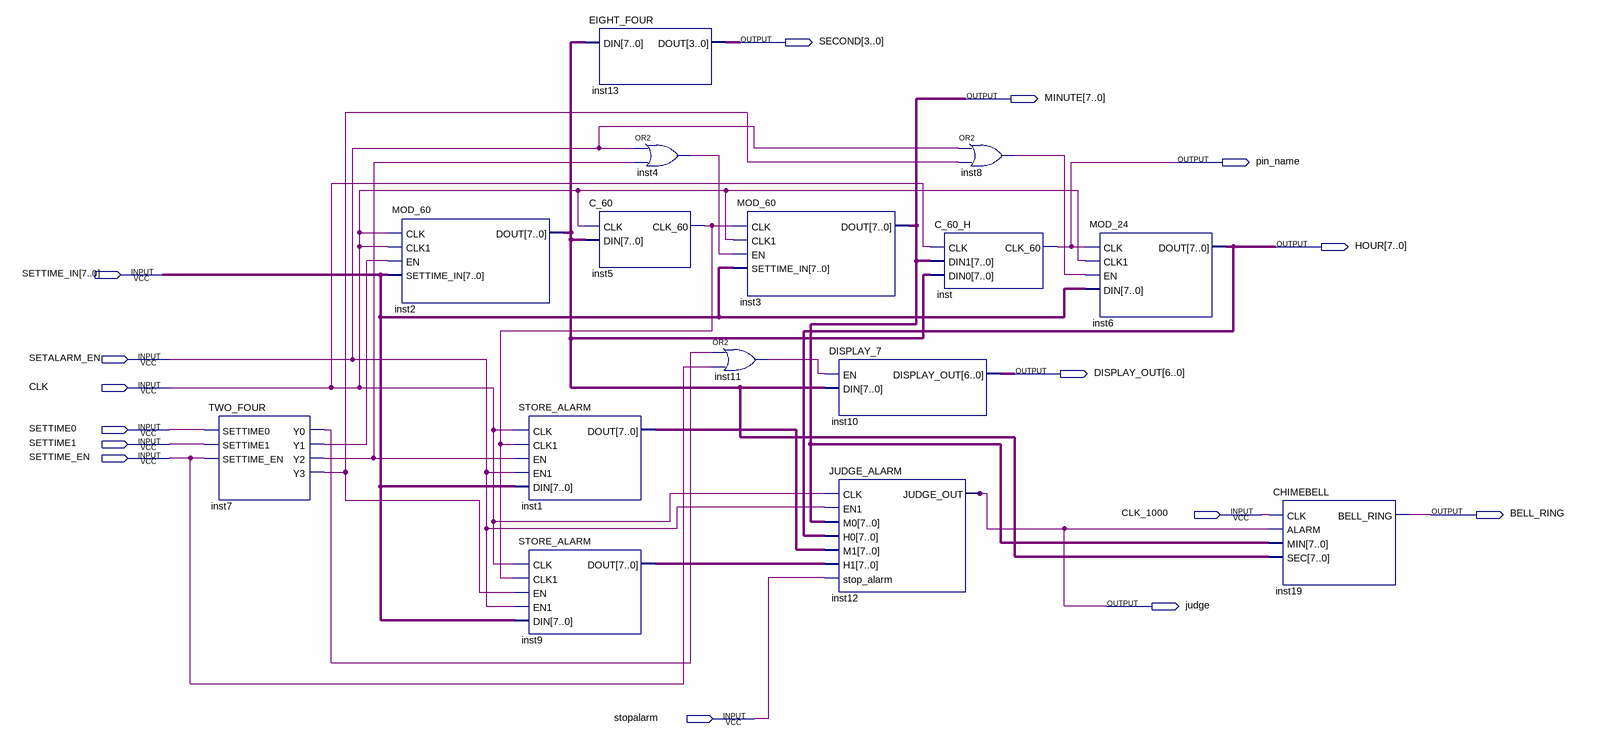
[diagram p0: schematic sheet]
// Quartus schematic DigitalLogic.bdf as structural Verilog: 15 symbols, 15 pins
module DigitalLogic (
  input  [7:0] SETTIME_IN,
  input  SETALARM_EN,
  input  CLK,
  input  SETTIME0,
  input  SETTIME1,
  input  SETTIME_EN,
  input  CLK_1000,
  input  stopalarm,
  output [3:0] SECOND,
  output [7:0] MINUTE,
  output pin_name,
  output [7:0] HOUR,
  output [6:0] DISPLAY_OUT,
  output BELL_RING,
  output judge
);

  wire inst4_out, inst5_clk_60, inst7_y0, inst7_y1, inst7_y2, inst7_y3, inst8_out, inst11_out;
  wire [7:0] inst1_dout, inst2_dout, inst9_dout;

  TWO_FOUR inst7 (
    .SETTIME0(SETTIME0), .SETTIME1(SETTIME1), .SETTIME_EN(SETTIME_EN), .Y0(inst7_y0), .Y1(inst7_y1),
    .Y2(inst7_y2), .Y3(inst7_y3));
  MOD_60 inst2 (.CLK(CLK), .CLK1(CLK), .EN(inst7_y1), .SETTIME_IN(SETTIME_IN), .DOUT(inst2_dout));
  STORE_ALARM inst1 (
    .CLK(CLK), .CLK1(inst5_clk_60), .EN(inst7_y2), .EN1(SETALARM_EN), .DIN(SETTIME_IN), .DOUT(inst1_dout));
  STORE_ALARM inst9 (
    .CLK(CLK), .CLK1(inst5_clk_60), .EN(inst7_y3), .EN1(SETALARM_EN), .DIN(SETTIME_IN), .DOUT(inst9_dout));
  EIGHT_FOUR inst13 (.DIN(inst2_dout), .DOUT(SECOND));
  C_60 inst5 (.CLK(CLK), .DIN(inst2_dout), .CLK_60(inst5_clk_60));
  or inst4 (inst4_out, SETALARM_EN, inst7_y2);
  MOD_60 inst3 (.CLK(inst5_clk_60), .CLK1(CLK), .EN(inst4_out), .SETTIME_IN(SETTIME_IN), .DOUT(MINUTE));
  or inst11 (inst11_out, inst7_y0, SETTIME_EN);
  DISPLAY_7 inst10 (.EN(inst11_out), .DIN(inst2_dout), .DISPLAY_OUT(DISPLAY_OUT));
  JUDGE_ALARM inst12 (
    .CLK(CLK), .EN1(SETALARM_EN), .M0(MINUTE), .H0(HOUR), .M1(inst1_dout), .H1(inst9_dout),
    .stop_alarm(stopalarm), .JUDGE_OUT(judge));
  or inst8 (inst8_out, SETALARM_EN, inst7_y3);
  C_60_H inst (.CLK(CLK), .DIN1(MINUTE), .DIN0(inst2_dout), .CLK_60(pin_name));
  MOD_24 inst6 (.CLK(pin_name), .CLK1(CLK), .EN(inst8_out), .DIN(SETTIME_IN), .DOUT(HOUR));
  CHIMEBELL inst19 (.CLK(CLK_1000), .ALARM(judge), .MIN(MINUTE), .SEC(inst2_dout), .BELL_RING(BELL_RING));
endmodule
